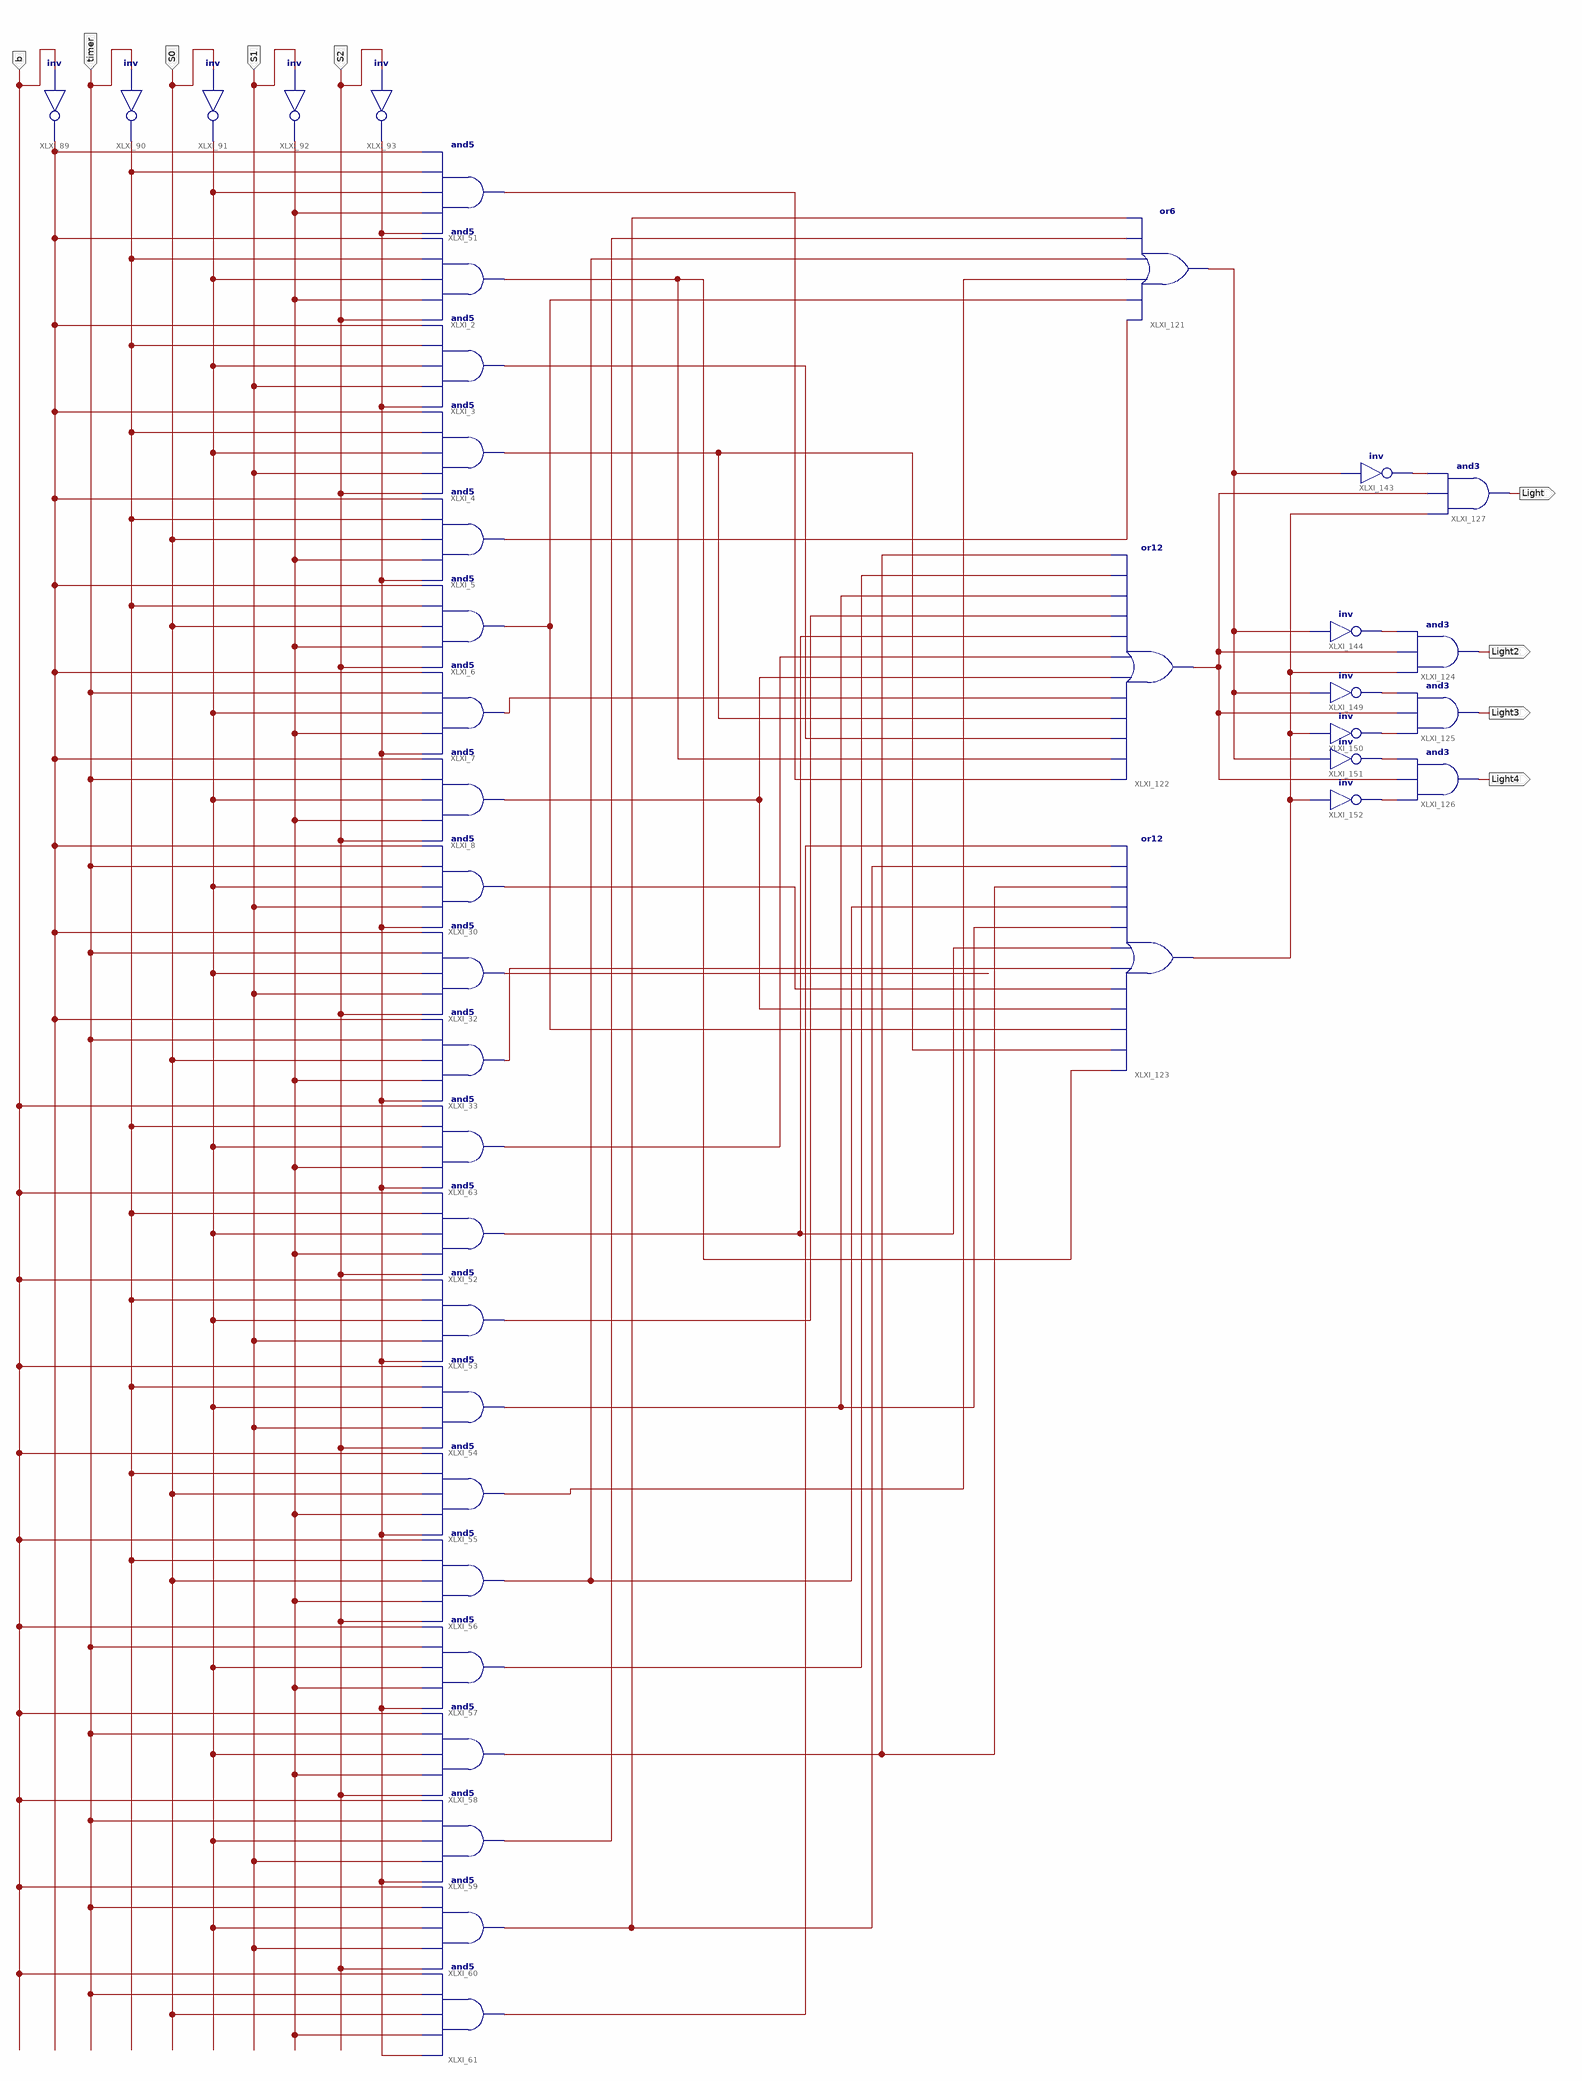
[diagram p0: schematic sheet 1]
// Xilinx ISE schematic traffic_light_schematic.sch (spartan3e) as structural Verilog: 40 symbols, 9 ports
module traffic_light_schematic (
  input  b,
  input  S0,
  input  timer,
  input  S1,
  input  S2,
  output Light2,
  output Light3,
  output Light4,
  output Light
);

  wire XLXN_27, XLXN_28, XLXN_29, XLXN_30, XLXN_31, XLXN_82, XLXN_83, XLXN_84, XLXN_85, XLXN_86, XLXN_87,
       XLXN_88, XLXN_89, XLXN_92, XLXN_93, XLXN_94, XLXN_95, XLXN_96, XLXN_97, XLXN_98, XLXN_99, XLXN_100,
       XLXN_101, XLXN_103, XLXN_113, XLXN_114, XLXN_115, XLXN_116, XLXN_117, XLXN_118, XLXN_119, XLXN_121,
       XLXN_122, XLXN_261, XLXN_265, XLXN_267;

  not XLXI_89 (XLXN_27, b);
  not XLXI_90 (XLXN_28, timer);
  not XLXI_91 (XLXN_29, S0);
  not XLXI_92 (XLXN_30, S1);
  not XLXI_93 (XLXN_31, S2);
  and XLXI_2 (XLXN_267, S2, XLXN_30, XLXN_29, XLXN_28, XLXN_27);
  and XLXI_3 (XLXN_101, XLXN_31, S1, XLXN_29, XLXN_28, XLXN_27);
  and XLXI_4 (XLXN_100, S2, S1, XLXN_29, XLXN_28, XLXN_27);
  and XLXI_5 (XLXN_99, XLXN_31, XLXN_30, S0, XLXN_28, XLXN_27);
  and XLXI_6 (XLXN_98, S2, XLXN_30, S0, XLXN_28, XLXN_27);
  and XLXI_7 (XLXN_97, XLXN_31, XLXN_30, XLXN_29, timer, XLXN_27);
  and XLXI_8 (XLXN_96, S2, XLXN_30, XLXN_29, timer, XLXN_27);
  and XLXI_30 (XLXN_95, XLXN_31, S1, XLXN_29, timer, XLXN_27);
  and XLXI_32 (XLXN_94, S2, S1, XLXN_29, timer, XLXN_27);
  and XLXI_33 (XLXN_93, XLXN_31, XLXN_30, S0, timer, XLXN_27);
  and XLXI_51 (XLXN_103, XLXN_31, XLXN_30, XLXN_29, XLXN_28, XLXN_27);
  and XLXI_52 (XLXN_121, S2, XLXN_30, XLXN_29, XLXN_28, b);
  and XLXI_53 (XLXN_122, XLXN_31, S1, XLXN_29, XLXN_28, b);
  and XLXI_54 (XLXN_89, S2, S1, XLXN_29, XLXN_28, b);
  and XLXI_55 (XLXN_88, XLXN_31, XLXN_30, S0, XLXN_28, b);
  and XLXI_56 (XLXN_87, S2, XLXN_30, S0, XLXN_28, b);
  and XLXI_57 (XLXN_86, XLXN_31, XLXN_30, XLXN_29, timer, b);
  and XLXI_58 (XLXN_85, S2, XLXN_30, XLXN_29, timer, b);
  and XLXI_59 (XLXN_84, XLXN_31, S1, XLXN_29, timer, b);
  and XLXI_60 (XLXN_83, S2, S1, XLXN_29, timer, b);
  and XLXI_61 (XLXN_82, XLXN_31, XLXN_30, S0, timer, b);
  and XLXI_63 (XLXN_92, XLXN_31, XLXN_30, XLXN_29, XLXN_28, b);
  or XLXI_121 (XLXN_113, XLXN_99, XLXN_98, XLXN_88, XLXN_87, XLXN_84, XLXN_83);
  or XLXI_122 (XLXN_265, XLXN_103, XLXN_267, XLXN_101, XLXN_100, XLXN_97, XLXN_96, XLXN_92, XLXN_121, XLXN_122, XLXN_89, XLXN_86, XLXN_85);
  or XLXI_123 (XLXN_261, XLXN_267, XLXN_100, XLXN_98, XLXN_96, XLXN_95, XLXN_93, XLXN_121, XLXN_89, XLXN_87, XLXN_85, XLXN_83, XLXN_82);
  and XLXI_126 (Light4, XLXN_119, XLXN_265, XLXN_118);
  and XLXI_125 (Light3, XLXN_117, XLXN_265, XLXN_116);
  and XLXI_124 (Light2, XLXN_261, XLXN_265, XLXN_115);
  not XLXI_144 (XLXN_115, XLXN_113);
  not XLXI_149 (XLXN_116, XLXN_113);
  not XLXI_150 (XLXN_117, XLXN_261);
  not XLXI_151 (XLXN_118, XLXN_113);
  not XLXI_152 (XLXN_119, XLXN_261);
  not XLXI_143 (XLXN_114, XLXN_113);
  and XLXI_127 (Light, XLXN_261, XLXN_265, XLXN_114);
endmodule
